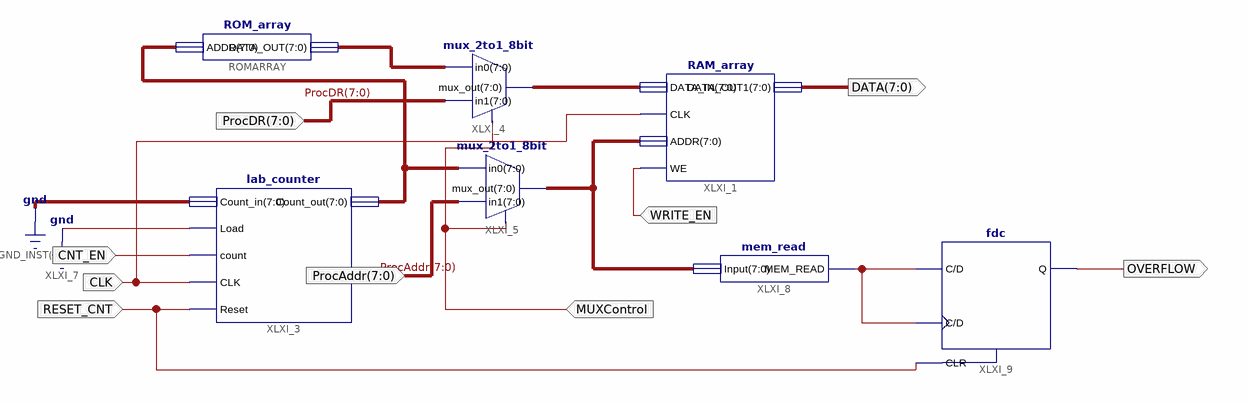
[diagram p0: schematic sheet 1]
// Xilinx ISE schematic mem_bootstrap.sch (spartan3e) as structural Verilog: 7 symbols, 9 ports
module mem_bootstrap (
  input  [7:0] ProcAddr,
  input  [7:0] ProcDR,
  input  CNT_EN,
  input  CLK,
  input  RESET_CNT,
  input  WRITE_EN,
  input  MUXControl,
  output [7:0] DATA,
  output OVERFLOW
);

  wire overflow_output;
  wire [7:0] XLXN_1, XLXN_2, XLXN_5, XLXN_6;

  RAM_array XLXI_1 (.ADDR(XLXN_6), .CLK(CLK), .DATA_IN(XLXN_5), .DATA_OUT1(DATA), .WE(WRITE_EN));
  ROM_array ROMARRAY (.ADDR(XLXN_2), .DATA_OUT(XLXN_1));
  lab_counter XLXI_3 (
    .Count_in({8{1'b0}}), .Load(1'b0), .count(CNT_EN), .CLK(CLK), .Reset(RESET_CNT), .Count_out(XLXN_2));
  mux_2to1_8bit XLXI_4 (.in0(XLXN_1), .sel(MUXControl), .mux_out(XLXN_5), .in1(ProcDR));
  mux_2to1_8bit XLXI_5 (.in0(XLXN_2), .sel(MUXControl), .mux_out(XLXN_6), .in1(ProcAddr));
  mem_read XLXI_8 (.Input(XLXN_6), .MEM_READ(overflow_output));
  fdc XLXI_9 (.C(overflow_output), .CLR(RESET_CNT), .D(overflow_output), .Q(OVERFLOW));
endmodule
